# Altium schematic sheet Altium Example Master Schematic Template Simple Generic.SchDoc: <page title>
size Letter; Author: JRL; Organization: Engenuics Technologies Inc; Address1: 1835 19 Avenue NW; Address2: Calgary, AB  T2M 1B6; Address3: CANADA; Address4: 1-403-998-1422; DocumentNumber: <PPPP-DTTT->; Revision: <###>; SheetNumber: <x>; SheetTotal: <y>
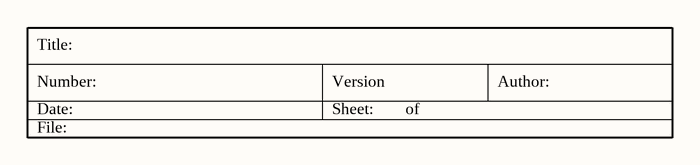
[diagram p0: Altium Example Master Schematic Template Simple Generic.SchDoc]

## Notes on the sheet
- Title:
- Number:
- Date:
- Version
- Sheet:
- of
- Author:
- File: